# EAGLE design Blimp_ESP_board_standalone_IC_power (EAGLE 9.7.0)
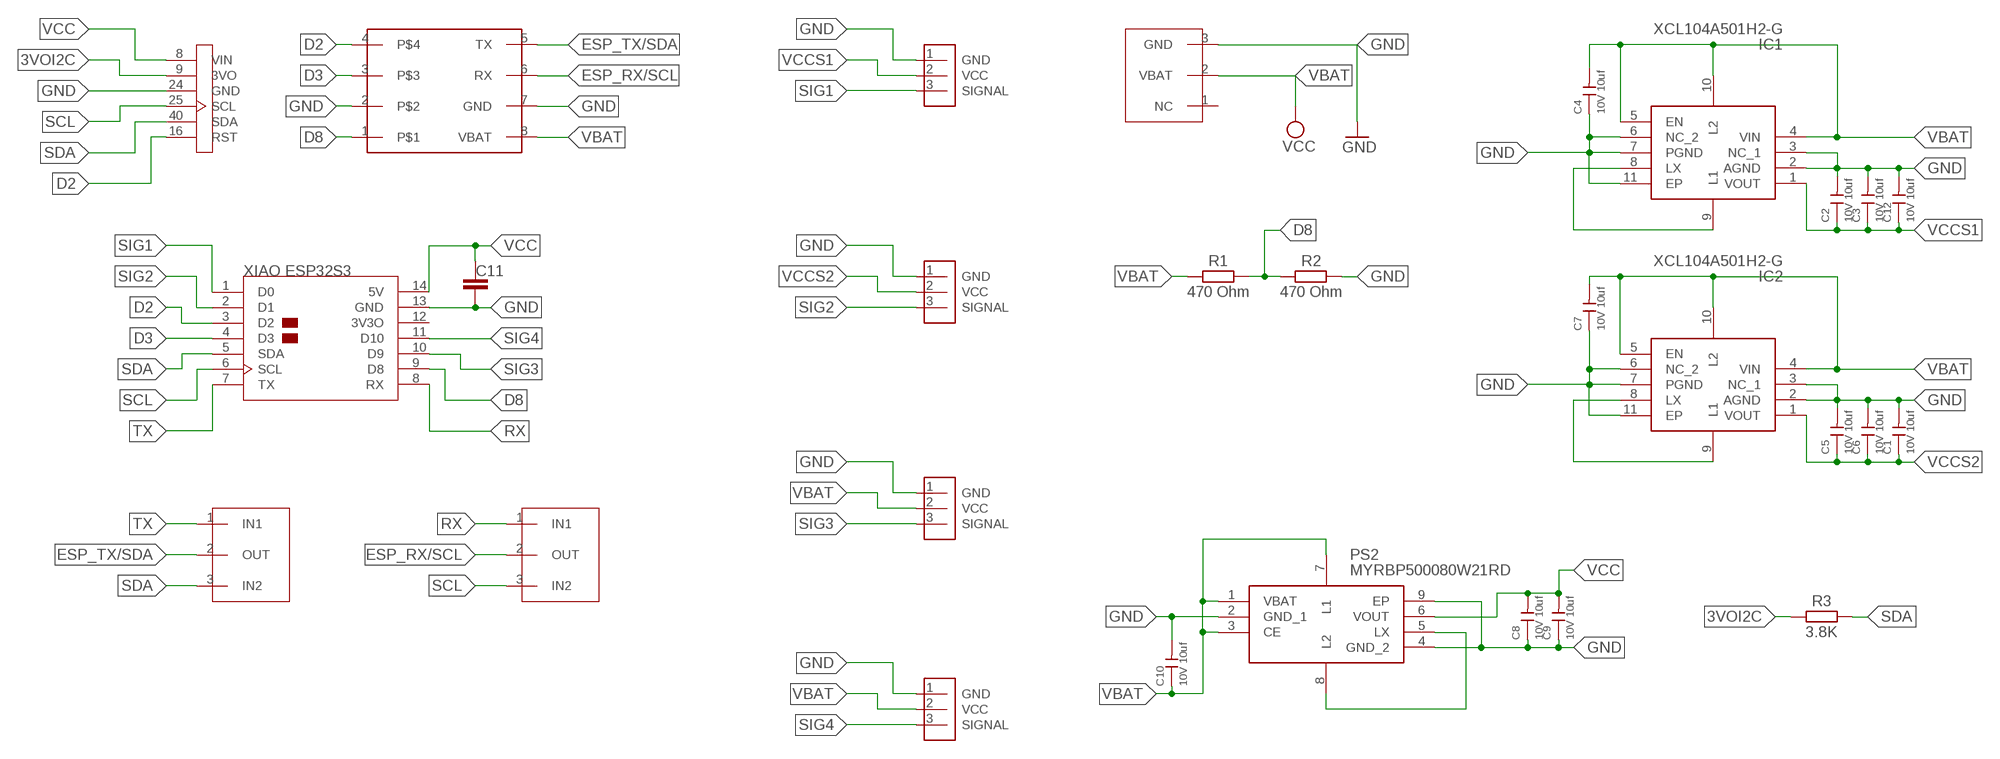
[diagram p0: schematic, sheet 1]

## Parts
ACT1  ESC  [ESC_CONECTOR_FOOT]
ACT2  ESC  [ESC_CONECTOR_FOOT]
ACT3  ESC  [ESC_CONECTOR_FOOT]
ACT4  ESC  [ESC_CONECTOR_FOOT]
C1  10V 10uf  CERAMIC-100PF-50V-5%-NPO(0402)  [C0402]
C2  10V 10uf  CERAMIC-100PF-50V-5%-NPO(0402)  [C0402]
C3  10V 10uf  CERAMIC-100PF-50V-5%-NPO(0402)  [C0402]
C4  10V 10uf  CERAMIC-100PF-50V-5%-NPO(0402)  [C0402]
C5  10V 10uf  CERAMIC-100PF-50V-5%-NPO(0402)  [C0402]
C6  10V 10uf  CERAMIC-100PF-50V-5%-NPO(0402)  [C0402]
C7  10V 10uf  CERAMIC-100PF-50V-5%-NPO(0402)  [C0402]
C8  10V 10uf  CERAMIC-100PF-50V-5%-NPO(0402)  [C0402]
C9  10V 10uf  CERAMIC-100PF-50V-5%-NPO(0402)  [C0402]
C10  10V 10uf  CERAMIC-100PF-50V-5%-NPO(0402)  [C0402]
C11  C_TANTALUM-1206(3216-METRIC)  [CAPM3216X180]
C12  10V 10uf  CERAMIC-100PF-50V-5%-NPO(0402)  [C0402]
IC1  XCL104A501H2-G  [DFN3030-10B]
IC2  XCL104A501H2-G  [DFN3030-10B]
PS2  MYRBP500080W21RD  [MYRBP500080W21RD]
R1  470 Ohm  R_CHIP-0603(1608-METRIC)  [RESC1608X60]
R2  470 Ohm  R_CHIP-0603(1608-METRIC)  [RESC1608X60]
R3  3.8K  R_CHIP-0603(1608-METRIC)  [RESC1608X60]
U1  XIAOESP32S3  [XIAOESP32S3]
U$1  BATTERY_CONNECTOR  [3PIN_CONNECTOR_FEMALE]
U$2  I2C_6PIN_WRST  [I2C_6PIN_WRST]
U$4  3X1SELECTOR  [3X1SELECTOR]
U$5  3X1SELECTOR  [3X1SELECTOR]
U$7  NICLA_ESP_4PIN_CONNECTOR_FEMALE_ON_ESP  [ESP_NICLA_4X2PIN_CONNECTOR_FEMALE_ON_ESP]

## Nets
3VOI2C: R3.1 U$2.9(3VO)
D2: U1.3(D2) U$2.16(RST) U$7.4
D3: U1.4(D3) U$7.3
D8: R1.2 R2.1 U1.9(D8) U$7.1
ESP_RX/SCL: U$5.2(OUT) U$7.6(RX)
ESP_TX/SDA: U$4.2(OUT) U$7.5(TX)
GND: ACT1.1(GND) ACT2.1(GND) ACT3.1(GND) ACT4.1(GND) C1.2 C2.2 C3.2 C4.1 C5.2 C6.2 C7.1 C8.1 C9.1 C10.2 C11.2 C12.2 IC1.2(AGND) IC1.3(NC_1) IC1.6(NC_2) IC1.7(PGND) IC1.11(EP) IC2.2(AGND) IC2.3(NC_1) IC2.6(NC_2) IC2.7(PGND) IC2.11(EP) PS2.2(GND_1) PS2.4(GND_2) PS2.9(EP) R2.2 U1.13(GND) U$1.3(GND) U$2.24(GND) U$7.2 U$7.7(GND)
N$1: IC1.8(LX) IC1.9(L1)
N$3: IC2.8(LX) IC2.9(L1)
N$5: PS2.5(LX) PS2.8(L2)
RX: U1.8(RX) U$5.1(IN1)
SCL: U1.6(SCL) U$2.25(SCL) U$5.3(IN2)
SDA: R3.2 U1.5(SDA) U$2.40(SDA) U$4.3(IN2)
SIG1: ACT3.3(SIGNAL) U1.1(D0)
SIG2: ACT2.3(SIGNAL) U1.2(D1)
SIG3: ACT1.3(SIGNAL) U1.10(D9)
SIG4: ACT4.3(SIGNAL) U1.11(D10)
TX: U1.7(TX) U$4.1(IN1)
VBAT: ACT1.2(VCC) ACT4.2(VCC) C4.2 C7.2 C10.1 IC1.4(VIN) IC1.5(EN) IC1.10(L2) IC2.4(VIN) IC2.5(EN) IC2.10(L2) PS2.1(VBAT) PS2.3(CE) PS2.7(L1) R1.1 U$1.2(VBAT) U$7.8(VBAT) ; supply symbol labelled VCC
VCC: C8.2 C9.2 C11.1 PS2.6(VOUT) U1.14(5V) U$2.8(VIN)
VCCS1: ACT3.2(VCC) C2.1 C3.1 C12.1 IC1.1(VOUT)
VCCS2: ACT2.2(VCC) C1.1 C5.1 C6.1 IC2.1(VOUT)
Unconnected: U1.12(3V3O) U$1.1(NC)

## Library data of the parts
ACT1-ACT4 = IMU_adaf:ESC
C1-C10 C12 = OPL_Capacitor:CERAMIC-100PF-50V-5%-NPO(0402): 302010012; MPN: CC0402JRNPO9BN101; VALUE: 100pf
C11 = Capacitor:C: Capacitor - Generic; CATEGORY: Capacitor
IC1 IC2 = XCL104A501H2-G:XCL104A501H2-G: 1.4A, Inductor Built-in Step-up DC/DC Converters Source: Datasheet <https://www.torexsemi.com/file/xcl104/XCL104.pdf>; DESCRIPTION: 1.4A, Inductor Built-in Step-up DC/DC Converters; HEIGHT: mm; MANUFACTURER_NAME: Torex; MANUFACTURER_PART_NUMBER: XCL104A501H2-G; MOUSER_PART_NUMBER: 865-XCL104A501H2-G; MOUSER_PRICE-STOCK: https://www.mouser.co.uk/ProductDetail/Torex-Semiconductor/XCL104A501H2-G?qs=amGC7iS6iy9pQcKiClP1fQ%3D%3D
PS2 = MYRBP500080W21RD:MYRBP500080W21RD: Non-Isolated DC/DC Converters Source: Datasheet <https://www.murata.com/products/productdata/8809985572894/MYRBP-B-W.pdf?1604930424000>; DESCRIPTION: Non-Isolated DC/DC Converters; HEIGHT: 1.04mm; MANUFACTURER_NAME: Murata Electronics; MANUFACTURER_PART_NUMBER: MYRBP500080W21RD; MOUSER_PART_NUMBER: 81-MYRBP500080W21RD; MOUSER_PRICE-STOCK: https://www.mouser.co.uk/ProductDetail/Murata-Electronics/MYRBP500080W21RD?qs=hd1VzrDQEGh%2Fg85ihM7iTw%3D%3D
R1-R3 = Resistor:R: Resistor Fixed - Generic; CATEGORY: Resistor; SUB-CATEGORY: Fixed
U1 = XIAO ESP32S3:XIAOESP32S3
U$1 = Blimp_power:BATTERY_CONNECTOR
U$2 = I2C_5Pin:I2C_6PIN_WRST
U$4 U$5 = Blimp_power:3X1SELECTOR
U$7 = NICLA_ESP_4PIN_CONNECTOR:NICLA_ESP_4PIN_CONNECTOR_FEMALE_ON_ESP

## Board
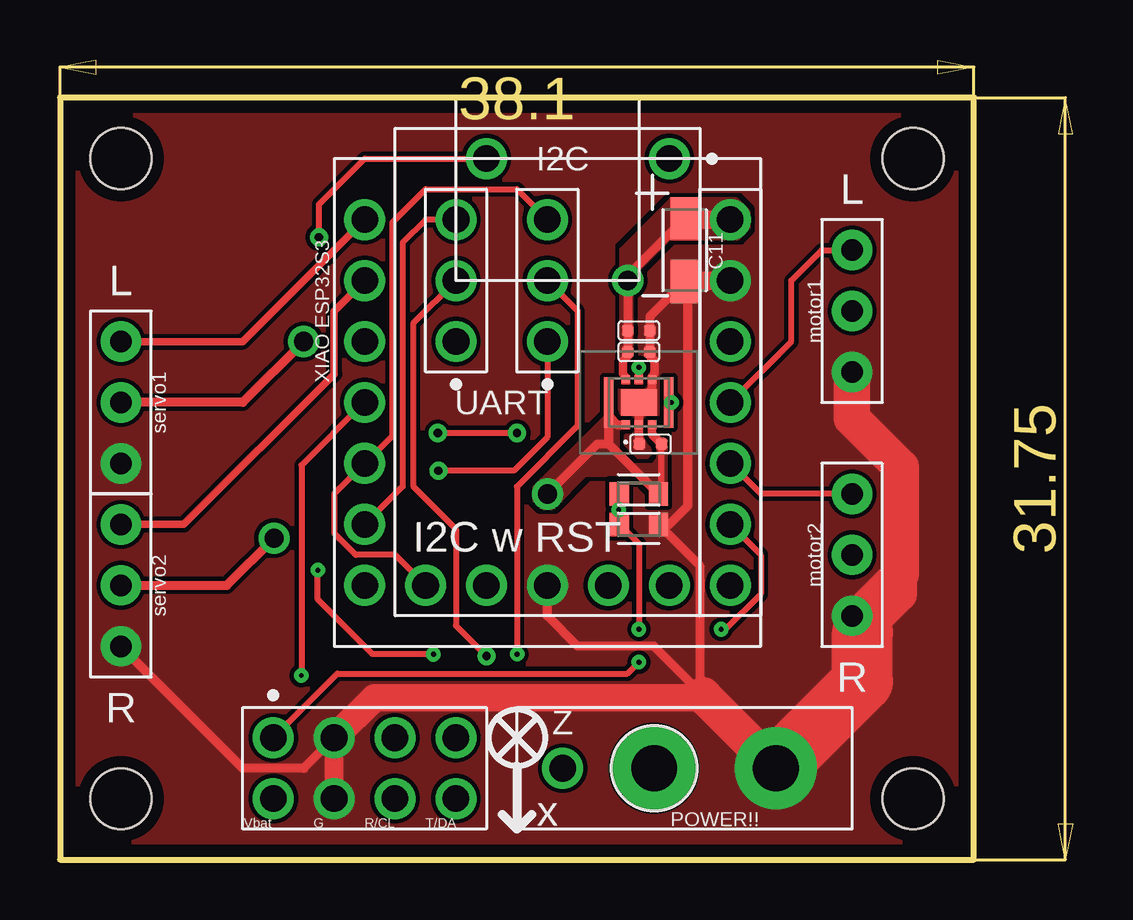
[diagram p1: board, top side]
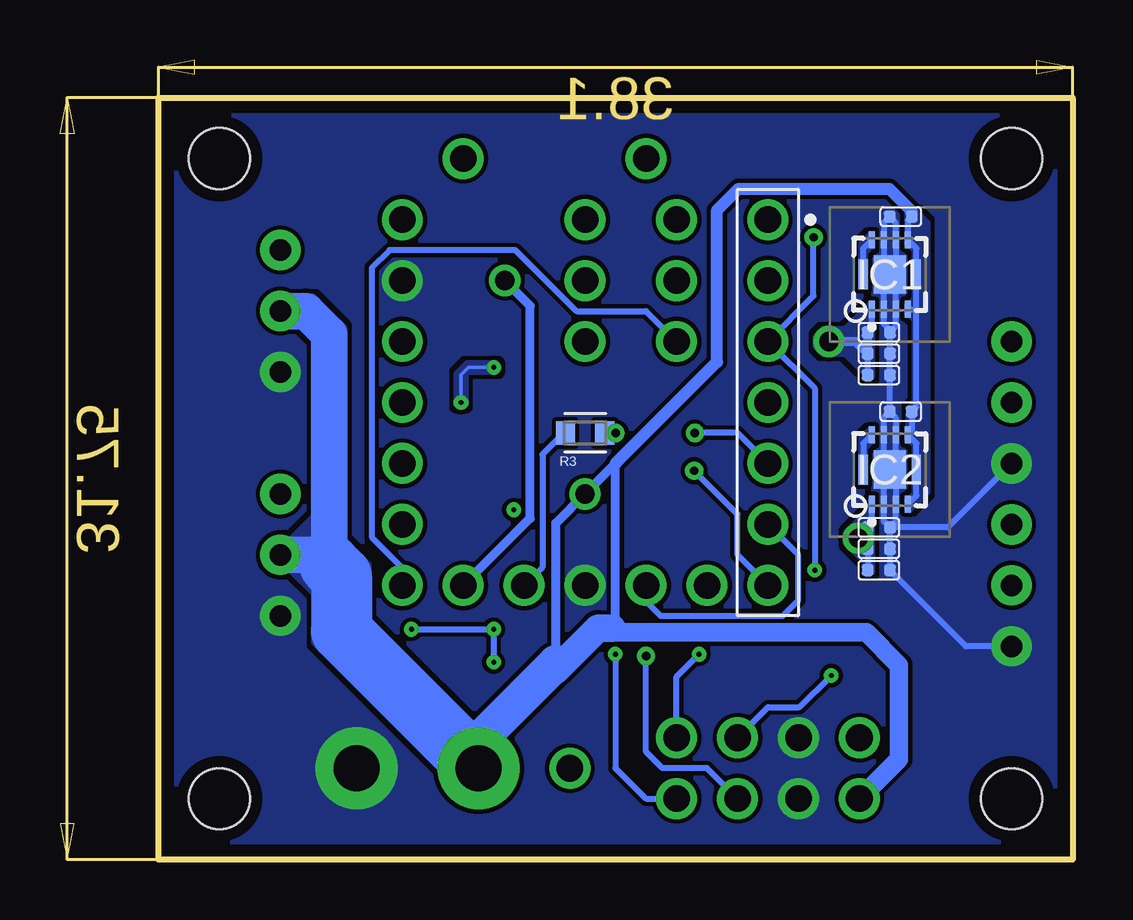
[diagram p2: board, bottom side, seen from below]

Size 38.1 x 31.75 mm. Coordinates in mm from the lower left corner, seen from the top.
Outline: 0,31.75 0,0 38.1,0 38.1,31.75 0,31.75
Copper layers (1*16): Top 0.035mm / dielectric 1.5mm / Bottom 0.035mm
Design rules "Fusion Electronics Design Rules": minimum track width 6mil, minimum drill 6mil, track to track 7mil, track to pad 7mil, pad to pad 7mil, via to via 7mil, smd to smd 0mil, copper to edge 20mil, drill to drill 7mil, minimum pad ring 10mil, minimum via ring 8mil, stop-mask expansion 4mil, vias tented up to drill 0mil, thermal gap 10mil
Holes 2.54 mm at 2.54,29.21 2.54,2.54 35.56,2.54 35.56,29.21

### Footprints (pad centres in the part's own frame; a part is rotated, then mirrored left to right if it is on the bottom)
ESC_CONECTOR_FOOT = drill 0.9 pad 1.676: 1 0,0; 2 2.54,0; 3 5.08,0
C0402 = smd 0.5 x 0.5: 1 0,0.463; 2 0,-0.463
CAPM3216X180 = smd 1.796 x 1.189: 1 -1.31,0; 2 1.31,0
DFN3030-10B = smd 0.25 x 0.7: 1 -0.75,-1.45; 2 -0.25,-1.45; 3 0.25,-1.45; 4 0.75,-1.45; 5 0.75,1.45; 6 0.25,1.45; 7 -0.25,1.45; 8 -0.75,1.45 | smd 0.38 x 1.25: 9 -1.11,0; 10 1.11,0 | smd 1.34 x 1.6: 11 0,0
MYRBP500080W21RD = smd 0.35 x 0.375: 1 -0.55,-0.938; 2 0,-0.938; 3 0.55,-0.938; 4 0.55,0.938; 5 0,0.938; 6 -0.55,0.938 | smd 0.4 x 2.1: 7 -1.25,0; 8 1.25,0 | smd 1.5 x 1.1: 9 0,0
RESC1608X60 = smd 0.799 x 0.974: 1 -0.815,0; 2 0.815,0
XIAOESP32S3 = drill 1.105 pad 1.705: 1 -26.67,-6.35; 2 -26.67,-8.89; 3 -26.67,-11.43; 4 -26.67,-13.97; 5 -26.67,-16.51; 6 -26.67,-19.05; 7 -26.67,-21.59; 8 -11.43,-21.59; 9 -11.43,-19.05; 10 -11.43,-16.51; 11 -11.43,-13.97; 12 -11.43,-11.43; 13 -11.43,-8.89; 14 -11.43,-6.35
3PIN_CONNECTOR_FEMALE = drill 1.105 pad 1.705: 1 -0.635,0 | drill 1.905 pad 3.429: 2 3.175,0; 3 8.255,0
I2C_6PIN_WRST = drill 1.105 pad 1.705: 1 11.43,-1.27; 8 11.43,-19.05; 9 8.89,-19.05; 16 3.81,-1.27; 24 6.35,-19.05; 25 3.81,-19.05; 40 1.27,-19.05
3X1SELECTOR = drill 1.105 pad 1.705: 1 0,0; 2 0,-2.54; 3 0,-5.08
ESP_NICLA_4X2PIN_CONNECTOR_FEMALE_ON_ESP = drill 1.105 pad 1.705: 1 0,0; 2 2.54,0; 3 5.08,0; 4 7.62,0; 5 7.62,-2.54; 6 5.08,-2.54; 7 2.54,-2.54; 8 0,-2.54

### Placement (x,y rotation side)
ACT1  33.02,10.16 90 top
ACT2  2.54,8.89 90 top
ACT3  2.54,16.51 90 top
ACT4  33.02,20.32 90 top
C1  8.08,12.06 90 bottom
C2  8.08,21.97 90 bottom
C3  8.08,21.08 90 bottom
C4  7.16,26.8 90 bottom
C5  8.08,12.95 90 bottom
C6  8.08,13.84 90 bottom
C7  7.16,18.67 90 bottom
C8  24.13,21.16 270 top
C9  24.13,22.05 270 top
C10  24.61,17.32 270 top
C11  26.04,25.4 270 top
C12  8.08,20.19 90 bottom
IC1  7.62,24.38 0 bottom
IC2  7.62,16.26 0 bottom
PS2  24.13,19.05 0 top
R1  24.13,15.24 180 top
R2  24.13,13.97 0 top
R3  20.32,17.78 0 bottom
U1  39.37,33.02 0 top
U$1  21.59,3.81 0 top
U$2  13.97,30.48 0 top
U$4  20.32,21.59 180 top
U$5  16.51,21.59 180 top
U$7  8.89,5.08 0 top

### Tracks (layer width: path | path; a pad name or v marks a point on that pad's centre or on a via)
3VOI2C
  Bottom 0.254: U$2.9 22.1,12.19 22.1,16.89 21.21,17.78 R3.1
D2  (via drill 0.2, 0.35)
  Top 0.254: v15.57,8.56 13.03,8.56 10.74,10.85 v10.74,12.06 v10.75,12.06 | v10.79,25.93 10.79,27.3 12.7,29.21 U$2.16
  Bottom 0.254: v15.57,8.56 16.51,7.62 U$7.4 | v10.75,12.06 v10.74,12.07 10.74,19.63 U1.3 10.79,23.5 v10.79,25.93
D3  (via drill 0.2)
  Top 0.254: U1.4 12.67,19.05 10.06,16.44 v10.06,7.68 v10.06,7.67
  Bottom 0.254: U$7.3 12.7,6.35 11.38,6.35 v10.06,7.67
D8  (via drill 0.2)
  Top 0.254: v24.13,9.6 24.13,13.15 R2.1 23.29,13.99 v23.29,14.58 23.29,15.22 R1.2 | U1.9 29.21,12.7 29.21,11.06 27.75,9.6 v27.56,9.6 | U$7.1 11.56,7.75 23.65,7.75 v24.13,8.23
  Bottom 0.254: v24.13,8.23 v24.13,9.6 v27.56,9.6
ESP_RX/SCL  (via drill 0.35)
  Top 0.254: v17.78,8.48 16.51,9.75 16.51,13.77 14.72,15.56 14.72,22.34 U$5.2
  Bottom 0.254: U$7.6 15.24,3.81 17.1,3.81 17.78,4.49 v17.78,8.48
ESP_TX/SDA  (via drill 0.2)
  Top 0.254: v19.06,8.56 v19.05,8.57 19.05,15.54 21.58,18.07 21.58,22.87 U$4.2
  Bottom 0.254: U$7.5 17.78,2.54 19.06,3.82 v19.06,8.56
GND
  Top 0.356: C10.2 24.13,17.34 PS2.2 PS2.9 24.68,19.6 PS2.4 24.68,20.13 24.79,20.24 24.79,20.79 24.59,20.98 C8.1 C9.1 24.59,22.65 26.07,24.13
  Top 0.381: 26.67,6.99 26.67,12.24 R2.2 25.4,13.97 26.16,14.73 26.16,23.96 C11.2 | 26.8,6.86 24.75,8.9 21.58,8.9 20.32,10.16 U$2.24 | ACT2.1 7.62,3.81 10.16,3.81 U$7.2
  Top 0.762: U1.13 26.07,24.13 C11.2 | U$7.2 U$7.7 | U$7.7 11.43,2.43 | U$7.2 U$7.7
  Top 1.143: 26.67,6.99 26.8,6.86 | 26.9,6.76 13.11,6.76 U$7.2
  Top 1.524: 34.98,13.01 34.98,11.07 34.06,10.16 ACT1.1 33.02,10.19 33.17,10.03 | ACT4.1 33.02,18.39 35.05,16.36 35.05,11.91 33.17,10.03 | 33.45,9.47 33.45,9.75 33.17,10.03 | U$1.3 26.9,6.76 26.8,6.86
  Top 2.54: U$1.3 33.45,7.42 33.45,9.47
  Bottom 0.254: C2.2 7.37,22.22 IC1.3 7.37,24.13 IC1.11 | C2.2 7.62,22.07 7.87,22.33 IC1.2 7.87,24.13 IC1.11 | C7.1 7.37,18.41 IC2.6 7.37,16.51 IC2.11 | C7.1 7.87,18.42 IC2.7 7.87,16.51 IC2.11 | IC2.11 7.87,16.01 IC2.2 7.87,14.1 C6.2 | IC2.11 7.37,16.01 IC2.3 7.37,14.09 C6.2 | IC1.11 7.87,24.63 IC1.7 7.87,26.55 C4.1 7.37,26.54 IC1.6 7.37,24.63 IC1.11 | C2.2 C3.2 7.62,21.07 7.62,21.06 C12.2 7.62,18.68 C7.1 | C6.2 C5.2 C1.2 4.44,8.89 ACT2.1 | ACT3.1 5.21,13.84 C6.2
  pour Top (isolate 0.254, rank 2, no thermals): 23.52,18.64 24.46,18.64 23.52,19.35
  pour Top (isolate 0.254, rank 2, no thermals): 32.31,7.92 32.29,7.88 28.7,4.29 28.7,3.33 29.34,2.69 30.94,2.69 35.69,7.44 35.69,15.97 33.67,17.99 33.66,18.03 33.66,20.19 32.38,20.19 32.38,17.88 34.35,15.92 34.37,15.87 34.37,12.01 34.35,11.97 32.31,9.93
  pour Bottom (rank 3, no thermals): 0.13,0.13 37.97,0.13 37.97,31.62 0.13,31.62
  pour Top (rank 3, no thermals): 0.13,0.13 37.97,0.13 37.97,31.62 0.13,31.62
N$1
  Bottom 0.254: IC1.9 8.73,25.47 IC1.8
  pour Bottom (rank 2, no thermals): 8.64,25.27 8.66,25.22 8.66,23.88 8.81,23.88 8.81,25.68 8.43,26.06 8.36,26.06 8.36,25.55
N$3
  Bottom 0.254: IC2.9 8.73,17.35 IC2.8
  pour Bottom (rank 2, no thermals): 8.64,17.14 8.66,17.09 8.66,15.75 8.81,15.75 8.81,17.55 8.43,17.93 8.36,17.93 8.36,17.43
N$5  (via drill 0.2)
  Top 0.152: v25.49,19.05 PS2.8
  Top 0.356: PS2.5 v24.13,20.51
  Bottom 0.152: v24.13,20.51 25.18,20.51 25.49,20.2 v25.49,19.05
  pour Bottom (rank 2, no thermals): 25.28,20.24 25.3,20.19 25.3,18.98 25.4,18.87 25.58,18.87 25.68,18.98 25.68,20.24 25.22,20.7 24.06,20.7 23.95,20.6 23.95,20.42 24.06,20.32 25.17,20.32 25.22,20.3
RX
  Bottom 0.254: U1.8 27.94,12.17 29.21,13.44 29.21,24.66 28.47,25.4 23.23,25.4 20.69,22.86 17.78,22.86 U$5.1
SCL
  Top 0.254: U$5.3 15.24,26.67 14.29,25.72 14.29,15.56 U1.6
  Bottom 0.254: U1.6 11.43,12.7 11.43,10.81 12.08,10.16 17.17,10.16 17.78,10.77 U$2.25
SDA  (via drill 0.35)
  Top 0.254: U$4.3 19.05,27.94 15.24,27.94 13.86,26.56 13.86,17.67 U1.5 11.43,15.24 11.43,13.6 12.33,12.7 13.97,12.7 U$2.40 | v15.75,17.78 v19.05,17.78
  Bottom 0.254: U1.5 13.97,17.78 v15.75,17.78 | v19.05,17.78 R3.2
SIG1
  Top 0.305: ACT3.3 7.62,21.59 U1.1
SIG2
  Top 0.305: U1.2 11.43,22.86 11.43,20.23 5.17,13.97 ACT2.3
SIG3
  Top 0.254: ACT1.3 29.21,15.24 U1.10
SIG4
  Top 0.254: U1.11 30.48,21.59 30.48,24.13 31.75,25.4 ACT4.3
TX  (via drill 0.35)
  Top 0.254: v15.78,16.21 18.93,16.21 20.32,17.6 U$4.1
  Bottom 0.254: U1.7 13.97,12.7 13.97,14.4 v15.78,16.21
VBAT  (via drill 0.8 pad 1.3)
  Top 0.254: C10.1 25.07,15.37 R1.1
  Top 0.356: C10.1 24.76,17.64 24.76,17.65 24.68,17.72 PS2.3
  Top 0.381: PS2.1 23.56,18.13 23.23,18.13 22.88,18.48 | 22.88,18.48 PS2.7 | 22.88,17.3 R1.1 | 22.88,17.3 22.88,18.48 | v20.32,15.24 22.39,17.3 22.88,17.3
  Bottom 0.152: 21.54,7.9 21.59,7.85 21.59,7.62 24.26,4.95 24.77,4.95
  Bottom 0.254: C4.2 6.87,26.63 IC1.5 6.51,25.47 IC1.10 6.51,22.86 | 6.51,22.86 6.58,22.93 IC1.4 | IC2.4 6.51,15.17 IC2.10 6.51,17.35 IC2.5 6.7,17.88 C7.2 6.51,18.86 6.51,22.86
  Bottom 0.381: 6.7,27.02 C4.2 | 21.54,8.18 21.54,14.02 v20.32,15.24 19.05,16.51 19.05,9.8 19.15,9.7 19.2,9.65
  Bottom 0.508: 19.05,16.51 14.82,20.74 14.82,27.07 13.93,27.95 7.63,27.95 6.7,27.02
  Bottom 0.762: U$7.8 7.24,4.19 7.24,8.11 8.6,9.47 18.92,9.47 19.15,9.7
  Bottom 1.143: 21.54,7.9 19.79,9.65 19.2,9.65
  Bottom 1.524: ACT4.2 31.95,22.86 30.98,21.89 30.98,12.68 | 30.98,12.68 30.98,12.32 | 30.98,12.68 31.01,12.7 ACT1.2 | U$1.2 24.77,4.95 21.54,8.18
  Bottom 2.54: U$1.2 30.48,9.53 30.48,11.82 30.98,12.32
  pour Top (isolate 0.254, no thermals): 19.81,15.47 19.81,15.01 20.12,14.71 20.52,14.71 21.87,16.06 21.92,16.08 24,16.08 24.05,16.06 24.64,15.46 24.66,15.42 24.66,14.88 25.22,14.88 25.22,17.42 25.19,17.45 25.04,17.45 25,17.47 24.73,17.73 24.71,17.78 24.71,18.16 24.64,18.16 24.64,17.71 24.95,17.39 24.97,17.35 24.97,16.69 24.95,16.64 24.71,16.4 24.66,16.38 23.9,16.38 23.85,16.4 23.23,17.02 23.22,17.07 23.22,17.88 23.23,17.93 23.35,18.04 23.39,18.06 23.62,18.06 23.62,18.19 23.29,18.19 23.25,18.21 22.98,18.47 22.96,18.52 22.96,19.96 22.81,19.96 22.81,18.49 22.79,18.44
  pour Bottom (isolate 0.254, rank 2, no thermals): 29.34,10.03 29.32,9.99 23.62,4.29 23.62,3.35 24.31,2.67 25.25,2.67 31.62,9.04 31.62,11.05 31.64,11.1 32.59,12.05 32.64,12.06 33.3,12.06 33.66,12.42 33.66,12.98 33.3,13.34 32.64,13.34 32.59,13.35 31.64,14.3 31.62,14.35 31.62,21.62 31.64,21.66 32.19,22.21 32.23,22.23 32.89,22.23 32.89,23.5 31.68,23.5 30.35,22.17 30.35,13.36 30.33,13.31 29.34,12.32
  pour Bottom (no thermals): 6.6,23.37 6.58,23.42 6.58,25.35 6.6,25.4 6.79,25.58 6.83,25.6 6.88,25.6 6.88,27 6.5,27 6.05,26.54 6.05,15.32 6.78,14.58 6.88,14.58 6.88,15.04 6.83,15.04 6.79,15.06 6.6,15.24 6.58,15.29 6.58,17.22 6.6,17.27 6.79,17.46 6.83,17.48 6.88,17.48 6.88,17.98 6.85,18.01 6.83,18.06 6.83,18.79 6.6,19.03 6.58,19.08 6.58,22.45 6.6,22.5 6.79,22.69 6.83,22.71 6.88,22.71 6.88,23.16 6.83,23.16 6.79,23.18
VCC  (via drill 0.8 pad 1.3)
  Top 0.356: PS2.6 23.58,20.13 23.47,20.24 23.47,20.79 23.67,20.98 C8.2 C9.2 v23.67,24.13 23.67,24.34 C11.1
  Top 0.762: U1.14 26.07,26.67 C11.1
  Bottom 0.381: v23.67,24.13 22.61,23.07 22.61,14.22 U$2.8
  pour Top (isolate 0.254, no thermals): 23.53,20.14 23.55,20.09 23.55,19.94 23.62,19.94 23.62,20.17 23.54,20.25 23.52,20.29 23.52,20.75 23.54,20.8 23.8,21.06 23.8,24.31 23.82,24.35 25.38,25.91 25.43,25.93 28.24,25.93 28.68,26.37 28.68,26.97 28.17,27.48 25.5,27.48 23.42,25.4 23.42,20.25
VCCS1  (via drill 0.8 pad 1.3)
  Top 0.381: v10.16,21.59 7.62,19.05 ACT3.2
  Bottom 0.254: C12.1 C3.1 | C2.1 8.37,22.14 IC1.1
  Bottom 0.381: C2.1 C3.1 9.05,21.59 v10.16,21.59
  pour Bottom (rank 2, no thermals): 10.69,21.82 10.39,22.12 9.5,22.12 9.45,22.14 8.43,23.16 8.36,23.16 8.36,20.12 8.41,20.07 8.66,20.07 8.66,20.07 8.66,20.22 8.68,20.26 9.45,21.04 9.5,21.06 10.39,21.06 10.69,21.36
VCCS2  (via drill 0.8 pad 1.3)
  Top 0.381: ACT2.2 6.96,11.43 v8.93,13.4
  Bottom 0.254: C6.1 C5.1 | C5.1 C1.1 | C6.1 8.93,13.46 v8.93,13.4 8.54,13.01 C5.1 | C6.1 8.37,14.01 IC2.1
  pour Bottom (rank 2, no thermals): 9.45,13.18 9.45,13.61 8.4,14.66 8.38,14.71 8.38,15.04 8.36,15.04 8.36,11.99 8.41,11.94 8.66,11.94 8.66,11.94 8.66,12.37 8.68,12.42

### Text on the board
tNames: I2C | L | L | motor1 | servo1 | UART | motor2 | servo2 | R | R | Z | x